# Altium schematic sheet Sheet_1 copy.schdoc
size 127 x 101 mm
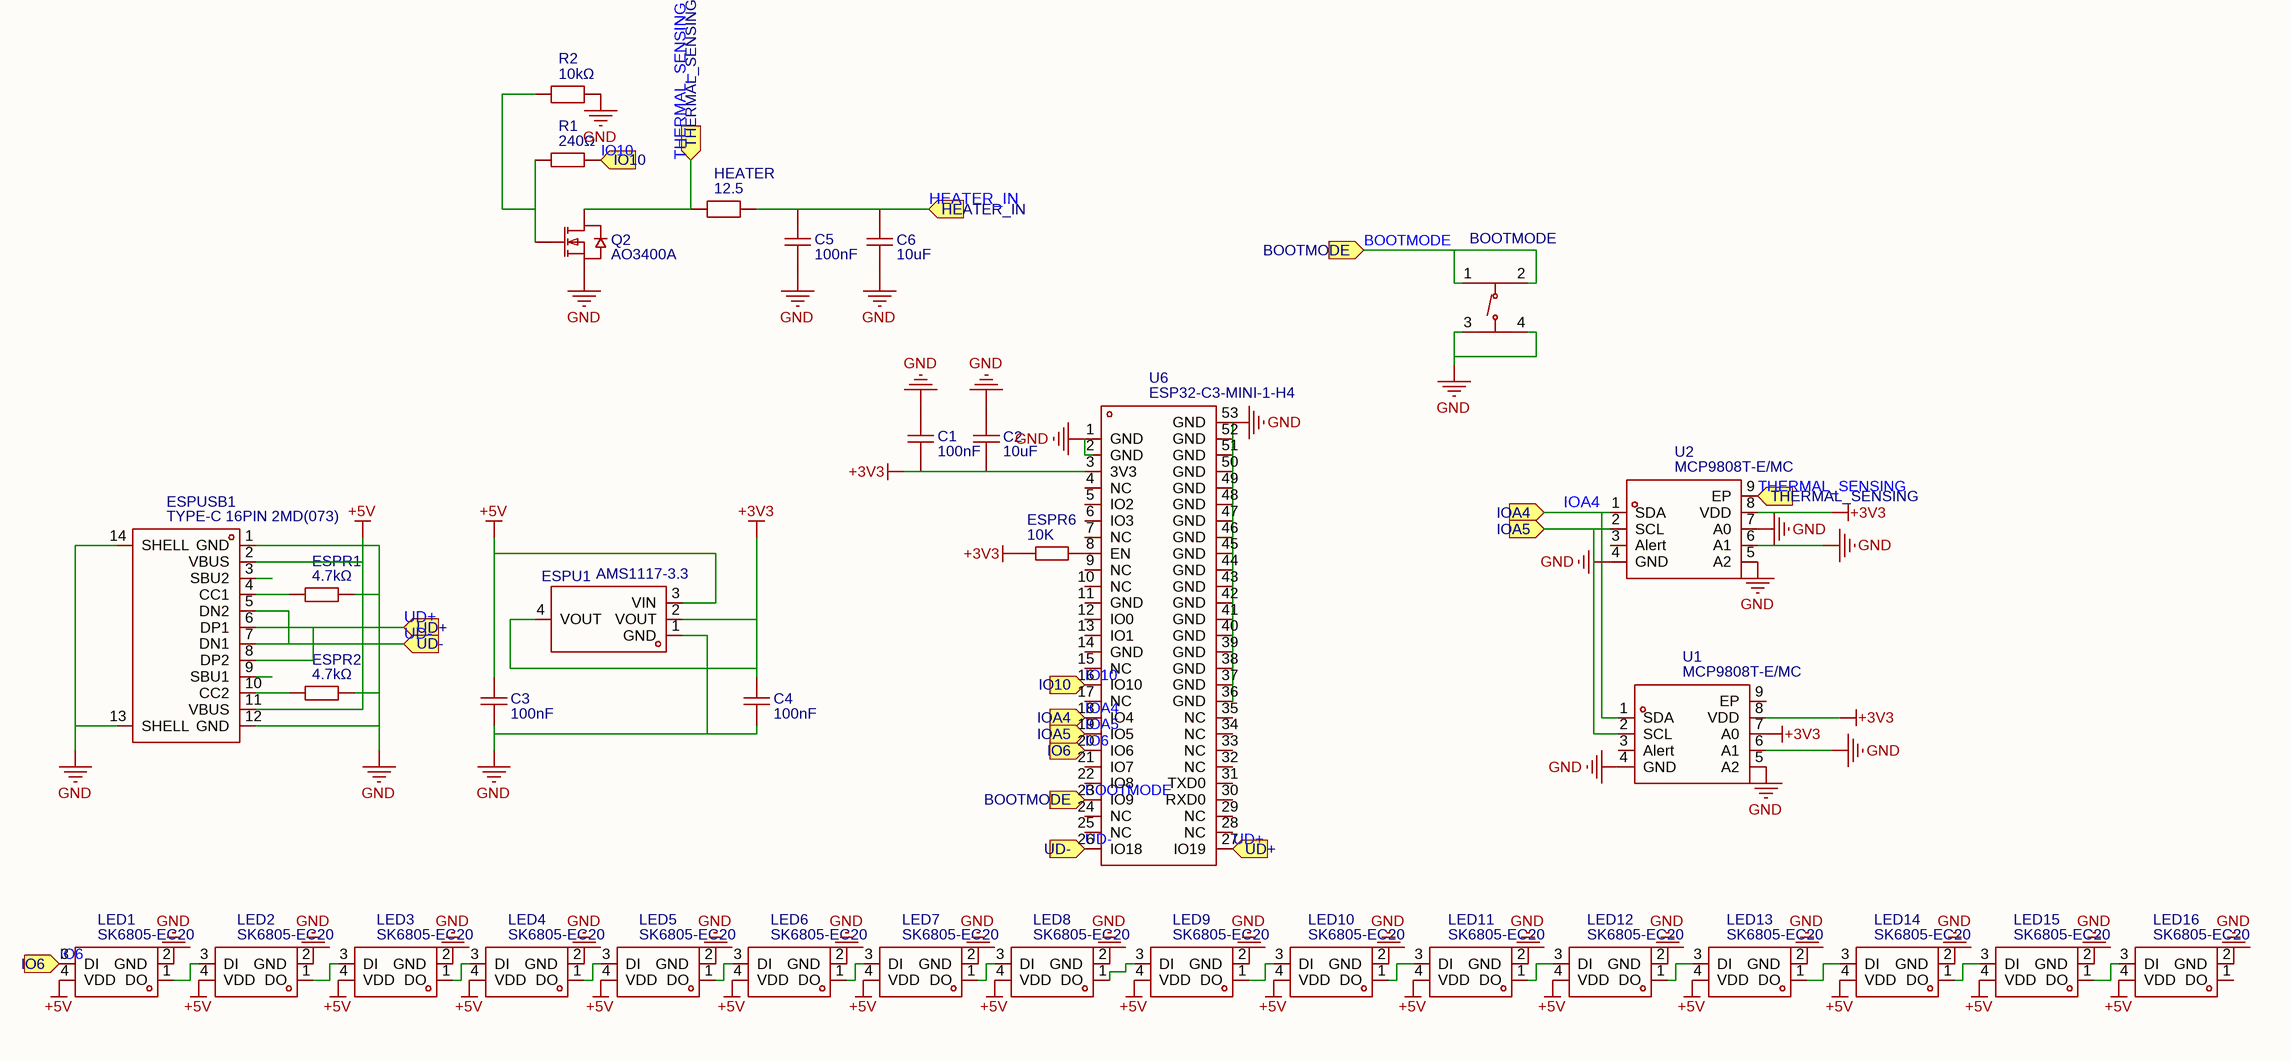
[diagram p0: Sheet_1 copy.schdoc]

## Parts
BOOTMODE  TS-1187A-B-A-B  [SW-SMD_4P-L5.1-W5.1-P3.70-LS6.5-TL-2]  (value not drawn)
C1  100nF  [C0603]
C2  10uF  [C0805]
C3  100nF  [C0603]
C4  100nF  [C0603]
C5  100nF  [C0603]
C6  10uF  [C0805]
ESPR1  4.7kΩ  [R0402]
ESPR2  4.7kΩ  [R0402]
ESPR6  10K  [R0402]
ESPU1  AMS1117-3.3  [SOT-223-3_L6.5-W3.4-P2.30-LS7.0-BR]
ESPUSB1  TYPE-C 16PIN 2MD(073)  [USB-C-SMD_TYPE-C-6PIN-2MD-073]
HEATER  12.5
LED1  SK6805-EC20  [LED-SMD_4P-L2.0-W2.0-TL_WS2812B-2020]
LED2  SK6805-EC20  [LED-SMD_4P-L2.0-W2.0-TL_WS2812B-2020]
LED3  SK6805-EC20  [LED-SMD_4P-L2.0-W2.0-TL_WS2812B-2020]
LED4  SK6805-EC20  [LED-SMD_4P-L2.0-W2.0-TL_WS2812B-2020]
LED5  SK6805-EC20  [LED-SMD_4P-L2.0-W2.0-TL_WS2812B-2020]
LED6  SK6805-EC20  [LED-SMD_4P-L2.0-W2.0-TL_WS2812B-2020]
LED7  SK6805-EC20  [LED-SMD_4P-L2.0-W2.0-TL_WS2812B-2020]
LED8  SK6805-EC20  [LED-SMD_4P-L2.0-W2.0-TL_WS2812B-2020]
LED9  SK6805-EC20  [LED-SMD_4P-L2.0-W2.0-TL_WS2812B-2020]
LED10  SK6805-EC20  [LED-SMD_4P-L2.0-W2.0-TL_WS2812B-2020]
LED11  SK6805-EC20  [LED-SMD_4P-L2.0-W2.0-TL_WS2812B-2020]
LED12  SK6805-EC20  [LED-SMD_4P-L2.0-W2.0-TL_WS2812B-2020]
LED13  SK6805-EC20  [LED-SMD_4P-L2.0-W2.0-TL_WS2812B-2020]
LED14  SK6805-EC20  [LED-SMD_4P-L2.0-W2.0-TL_WS2812B-2020]
LED15  SK6805-EC20  [LED-SMD_4P-L2.0-W2.0-TL_WS2812B-2020]
LED16  SK6805-EC20  [LED-SMD_4P-L2.0-W2.0-TL_WS2812B-2020]
Q2  AO3400A  [SOT-23-3_L2.9-W1.3-P1.90-LS2.4-BR]
R1  240Ω  [R0805]
R2  10kΩ  [R0805]
U1  MCP9808T-E/MC  [DFN-8_L3.0-W2.0-P0.50-TL-EP-1]
U2  MCP9808T-E/MC  [DFN-8_L3.0-W2.0-P0.50-TL-EP-1]
U6  ESP32-C3-MINI-1-H4  [WIFIM-SMD_ESP32-C3-MINI-1]

## Ports
BOOTMODE (in), HEATER_IN (in), IO6 (in), IO10 (in), IOA4 (in), IOA5 (in), THERMAL_SENSING (in), UD+ (in), UD- (in)

## Nets
+3V3: C1.1 C2.2 C4.2 ESPR6.2 ESPU1.2(VOUT) ESPU1.4(VOUT) U1.7(A0) U1.8(VDD) U2.8(VDD) U6.3(3V3)
+5V: C3.2 ESPU1.3(VIN) ESPUSB1.2(VBUS) ESPUSB1.11(VBUS) LED1.4(VDD) LED2.4(VDD) LED3.4(VDD) LED4.4(VDD) LED5.4(VDD) LED6.4(VDD) LED7.4(VDD) LED8.4(VDD) LED9.4(VDD) LED10.4(VDD) LED11.4(VDD) LED12.4(VDD) LED13.4(VDD) LED14.4(VDD) LED15.4(VDD) LED16.4(VDD)
GND: BOOTMODE.3(C) BOOTMODE.4(D) C1.2 C2.1 C3.1 C4.1 C5.1 C6.2 ESPR1.2 ESPR2.2 ESPU1.1(GND) ESPUSB1.1(GND) ESPUSB1.12(GND) ESPUSB1.13(SHELL) ESPUSB1.14(SHELL) LED1.2(GND) LED2.2(GND) LED3.2(GND) LED4.2(GND) LED5.2(GND) LED6.2(GND) LED7.2(GND) LED8.2(GND) LED9.2(GND) LED10.2(GND) LED11.2(GND) LED12.2(GND) LED13.2(GND) LED14.2(GND) LED15.2(GND) LED16.2(GND) Q2.2(S) R2.2 U1.4(GND) U1.5(A2) U1.6(A1) U2.4(GND) U2.5(A2) U2.6(A1) U2.7(A0) U6.1(GND) U6.2(GND) U6.36(GND) U6.37(GND) U6.38(GND) U6.39(GND) U6.40(GND) U6.41(GND) U6.42(GND) U6.43(GND) U6.44(GND) U6.45(GND) U6.46(GND) U6.47(GND) U6.48(GND) U6.49(GND) U6.50(GND) U6.51(GND) U6.52(GND) U6.53(GND)
BOOTMODE: BOOTMODE.1(A) BOOTMODE.2(B) U6.23(IO9) ; port BOOTMODE
HEATER_IN: C5.2 C6.1 HEATER.2 ; port HEATER_IN
IO6: LED1.3(DI) U6.20(IO6) ; port IO6
IO10: R1.2 U6.16(IO10) ; port IO10
IOA4: U1.1(SDA) U2.1(SDA) U6.18(IO4) ; port IOA4
IOA5: U1.2(SCL) U2.2(SCL) U6.19(IO5) ; port IOA5
THERMAL_SENSING: HEATER.1 Q2.3(D) U2.9(EP) ; port THERMAL_SENSING
UD+: ESPUSB1.6(DP1) ESPUSB1.8(DP2) U6.27(IO19) ; port UD+
UD-: ESPUSB1.5(DN2) ESPUSB1.7(DN1) U6.26(IO18) ; port UD-
NetESPR1_1: ESPR1.1 ESPUSB1.4(CC1)
NetESPR2_1: ESPR2.1 ESPUSB1.10(CC2)
NetESPR6_1: ESPR6.1 U6.8(EN)
NetLED1_1: LED1.1(DO) LED2.3(DI)
NetLED2_1: LED2.1(DO) LED3.3(DI)
NetLED3_1: LED3.1(DO) LED4.3(DI)
NetLED4_1: LED4.1(DO) LED5.3(DI)
NetLED5_1: LED5.1(DO) LED6.3(DI)
NetLED6_1: LED6.1(DO) LED7.3(DI)
NetLED7_1: LED7.1(DO) LED8.3(DI)
NetLED8_1: LED8.1(DO) LED9.3(DI)
NetLED9_1: LED9.1(DO) LED10.3(DI)
NetLED10_1: LED10.1(DO) LED11.3(DI)
NetLED11_1: LED11.1(DO) LED12.3(DI)
NetLED12_1: LED12.1(DO) LED13.3(DI)
NetLED13_1: LED13.1(DO) LED14.3(DI)
NetLED14_1: LED14.1(DO) LED15.3(DI)
NetLED15_1: LED15.1(DO) LED16.3(DI)
NetQ2_1: Q2.1(G) R1.1 R2.1

Not connected (* = marked no-connect by the designer): ESPUSB1 3(SBU2) 9(SBU1); LED16 1(DO); U1 3(Alert) 9(EP); U2 3(Alert); U6 4(NC) 5(IO2) 6(IO3) 7(NC) 9(NC) 10(NC) 11(GND) 12(IO0) 13(IO1) 14(GND) 15(NC) 17(NC) 21(IO7) 22(IO8) 24(NC) 25(NC) 28(NC) 29(NC) 30(RXD0) 31(TXD0) 32(NC) 33(NC) 34(NC) 35(NC)

## Library data of the parts
BOOTMODE = TS-1187A-B-A-B: Manufacturer: XKB Connectivity(中国星坤); Contributor: LCSC; Convert to PCB: yes; UniqueId: gge6f5c0bc02024a939; Origin Footprint: SW-SMD_4P-L5.1-W5.1-P3.70-LS6.5-TL-2; Device: TS-1187A-B-A-B; Symbol: TS-1187A-B-A-B; Supplier: LCSC; Supplier Part: C318884; Manufacturer Part: TS-1187A-B-A-B; JLCPCB Part Class: Basic Part; link: https://lcsc.com/eda_search?q=C318884&%26type=1&ref=editor; spicePre: S; spiceSymbolName: TS-1187A-B-A-B; Add into BOM: yes; FootprintName: SW-SMD_4P-L5.1-W5.1-P3.70-LS6.5-TL-2
C1 = 100nF: Manufacturer: SAMSUNG(三星); Manufacturer Part: CL10B104KB8NNNC; nameAlias: Value; Convert to PCB: yes; UniqueId: gge84f2f2bcbf7fae9e; ModelId: aa7bfa10aa9749d3a2674a0b8f4166b3; Origin Footprint: C0603; Device: 100nF; Symbol: 100nF; Supplier: LCSC; Supplier Part: C1591; JLCPCB Part Class: Extended Part; spicePre: C; spiceSymbolName: CL10B104KB8NNNC; Add into BOM: yes; FootprintName: C0603; ModelName: C0603
C2 = 10uF: Manufacturer Part: CL21A106KAYNNNE; Manufacturer: SAMSUNG(三星); nameAlias: Value; Convert to PCB: yes; UniqueId: gge08d787491a595ea2; Origin Footprint: C0805; Device: 10uF; Symbol: 10uF; Supplier: LCSC; Supplier Part: C15850; JLCPCB Part Class: Basic Part; spicePre: C; spiceSymbolName: CL21A106KAYNNNE; Add into BOM: yes; FootprintName: C0805
C3 = 100nF: Manufacturer: SAMSUNG(三星); Manufacturer Part: CL10B104KB8NNNC; nameAlias: Value; Convert to PCB: yes; UniqueId: ggec7a2ba2ae3201229; ModelId: aa7bfa10aa9749d3a2674a0b8f4166b3; Origin Footprint: C0603; Device: 100nF; Symbol: 100nF; Supplier: LCSC; Supplier Part: C1591; JLCPCB Part Class: Extended Part; spicePre: C; spiceSymbolName: CL10B104KB8NNNC; Add into BOM: yes; FootprintName: C0603; ModelName: C0603
C4 = 100nF: Manufacturer: SAMSUNG(三星); Manufacturer Part: CL10B104KB8NNNC; nameAlias: Value; Convert to PCB: yes; UniqueId: gge816a6adfd29f7601; ModelId: aa7bfa10aa9749d3a2674a0b8f4166b3; Origin Footprint: C0603; Device: 100nF; Symbol: 100nF; Supplier: LCSC; Supplier Part: C1591; JLCPCB Part Class: Extended Part; spicePre: C; spiceSymbolName: CL10B104KB8NNNC; Add into BOM: yes; FootprintName: C0603; ModelName: C0603
C5 = 100nF: Manufacturer: SAMSUNG(三星); Manufacturer Part: CL10B104KB8NNNC; nameAlias: Value; Convert to PCB: yes; UniqueId: ggef034be5c27e22ecd; ModelId: aa7bfa10aa9749d3a2674a0b8f4166b3; Origin Footprint: C0603; Device: 100nF; Symbol: 100nF; Supplier: LCSC; Supplier Part: C1591; JLCPCB Part Class: Extended Part; spicePre: C; spiceSymbolName: CL10B104KB8NNNC; Add into BOM: yes; FootprintName: C0603; ModelName: C0603
C6 = 10uF: Manufacturer Part: CL21A106KAYNNNE; Manufacturer: SAMSUNG(三星); nameAlias: Value; Convert to PCB: yes; UniqueId: gge3116aae71de1f0fc; Origin Footprint: C0805; Device: 10uF; Symbol: 10uF; Supplier: LCSC; Supplier Part: C15850; JLCPCB Part Class: Basic Part; spicePre: C; spiceSymbolName: CL21A106KAYNNNE; Add into BOM: yes; FootprintName: C0805
ESPR1 = 4.7kΩ: Manufacturer: UniOhm; Manufacturer Part: 0402WGF4701TCE; nameAlias: Resistance; Convert to PCB: yes; UniqueId: gge7ddcad7e77d19d0b; Resistance: 4.7K; Origin Footprint: R0402; Device: 4.7kΩ; Symbol: 4.7kΩ; Supplier: LCSC; Supplier Part: C25900; JLCPCB Part Class: Basic Part; spicePre: R; spiceSymbolName: 0402WGF4701TCE; Add into BOM: yes; FootprintName: R0402
ESPR2 = 4.7kΩ: Manufacturer: UniOhm; Manufacturer Part: 0402WGF4701TCE; nameAlias: Resistance; Convert to PCB: yes; UniqueId: gge07cadfaee7eab313; Resistance: 4.7K; Origin Footprint: R0402; Device: 4.7kΩ; Symbol: 4.7kΩ; Supplier: LCSC; Supplier Part: C25900; JLCPCB Part Class: Basic Part; spicePre: R; spiceSymbolName: 0402WGF4701TCE; Add into BOM: yes; FootprintName: R0402
ESPR6 = 10K: Manufacturer: UniOhm; Manufacturer Part: 0402WGF1002TCE; nameAlias: Resistance (Ohms); Convert to PCB: yes; UniqueId: ggec3da87eea95b4c0c; Origin Footprint: R0402; Device: 10K; Symbol: 10K; Supplier: LCSC; Supplier Part: C25744; JLCPCB Part Class: Basic Part; spicePre: R; spiceSymbolName: 0402WGF1002TCE; Add into BOM: yes; FootprintName: R0402
ESPU1 = AMS1117-3.3: Manufacturer: AMS; sourceId: dwIGgezVh; Convert to PCB: yes; UniqueId: ggecf1c38b7d7d46bad; Origin Footprint: SOT-223-3_L6.5-W3.4-P2.30-LS7.0-BR; Device: AMS1117-3.3; Symbol: AMS1117-3.3; timeStamp: 1476261164; Supplier: LCSC; Manufacturer Part: AMS1117-3.3; Supplier Part: C6186; JLCPCB Part Class: Basic Part; spicePre: U; spiceSymbolName: AMS1117-3.3; Add into BOM: yes; FootprintName: SOT-223-3_L6.5-W3.4-P2.30-LS7.0-BR
ESPUSB1 = TYPE-C 16PIN 2MD(073): Manufacturer: SHOU HAN(首韩); Contributor: LCSC; Convert to PCB: yes; UniqueId: ggecd2bb17442b0efce; ModelId: e7514eef573e45b68df9e9a6124b2532; Origin Footprint: USB-C-SMD_TYPE-C-6PIN-2MD-073; Device: TYPE-C 16PIN 2MD(073); Symbol: TYPE-C 16PIN 2MD(073); Supplier: LCSC; Supplier Part: C2765186; Manufacturer Part: TYPE-C 16PIN 2MD(073); JLCPCB Part Class: Extended Part; spicePre: U; spiceSymbolName: TYPE-C 16PIN 2MD(073); Add into BOM: yes; FootprintName: USB-C-SMD_TYPE-C-6PIN-2MD-073; ModelName: USB-C-SMD_TYPE-C-6PIN-2MD-073
HEATER = 12.5: Origin Footprint: HEATER_SPIRAL_5CM; nameAlias: Value(Ω); Contributor: LCEDA_Lib; Package Display: No; Convert to PCB: yes; UniqueId: gge0336805703def1c8; Device: 12.5; Symbol: 12.5; spicePre: R; spiceSymbolName: R_0603_EU; Add into BOM: yes
LED1 = SK6805-EC20: Manufacturer: OPSCO Optoelectronics; Contributor: LCSC; Paste Type: expand; Convert to PCB: yes; UniqueId: gge16e2428176fb5ac1; Origin Footprint: LED-SMD_4P-L2.0-W2.0-TL_WS2812B-2020; Device: SK6805-EC20; Symbol: SK6805-EC20; Supplier: LCSC; Supplier Part: C2890036; Manufacturer Part: SK6805-EC20; LCSC Assembly: Yes; spicePre: L; spiceSymbolName: WS2812B-2020; Add into BOM: yes; JLCPCB Part Class: Extend; FootprintName: LED-SMD_4P-L2.0-W2.0-TL_WS2812B-2020
LED2 = SK6805-EC20: Manufacturer: OPSCO Optoelectronics; Contributor: LCSC; Paste Type: expand; Convert to PCB: yes; UniqueId: gge4831e16003f23f36; Origin Footprint: LED-SMD_4P-L2.0-W2.0-TL_WS2812B-2020; Device: SK6805-EC20; Symbol: SK6805-EC20; Supplier: LCSC; Supplier Part: C2890036; Manufacturer Part: SK6805-EC20; LCSC Assembly: Yes; spicePre: L; spiceSymbolName: WS2812B-2020; Add into BOM: yes; JLCPCB Part Class: Extend; FootprintName: LED-SMD_4P-L2.0-W2.0-TL_WS2812B-2020
LED3 = SK6805-EC20: Manufacturer: OPSCO Optoelectronics; Contributor: LCSC; Paste Type: expand; Convert to PCB: yes; UniqueId: ggeac12866c02b89667; Origin Footprint: LED-SMD_4P-L2.0-W2.0-TL_WS2812B-2020; Device: SK6805-EC20; Symbol: SK6805-EC20; Supplier: LCSC; Supplier Part: C2890036; Manufacturer Part: SK6805-EC20; LCSC Assembly: Yes; spicePre: L; spiceSymbolName: WS2812B-2020; Add into BOM: yes; JLCPCB Part Class: Extend; FootprintName: LED-SMD_4P-L2.0-W2.0-TL_WS2812B-2020
LED4 = SK6805-EC20: Manufacturer: OPSCO Optoelectronics; Contributor: LCSC; Paste Type: expand; Convert to PCB: yes; UniqueId: ggef2f2a78f3e332c30; Origin Footprint: LED-SMD_4P-L2.0-W2.0-TL_WS2812B-2020; Device: SK6805-EC20; Symbol: SK6805-EC20; Supplier: LCSC; Supplier Part: C2890036; Manufacturer Part: SK6805-EC20; LCSC Assembly: Yes; spicePre: L; spiceSymbolName: WS2812B-2020; Add into BOM: yes; JLCPCB Part Class: Extend; FootprintName: LED-SMD_4P-L2.0-W2.0-TL_WS2812B-2020
LED5 = SK6805-EC20: Manufacturer: OPSCO Optoelectronics; Contributor: LCSC; Paste Type: expand; Convert to PCB: yes; UniqueId: gged071155d0386b246; Origin Footprint: LED-SMD_4P-L2.0-W2.0-TL_WS2812B-2020; Device: SK6805-EC20; Symbol: SK6805-EC20; Supplier: LCSC; Supplier Part: C2890036; Manufacturer Part: SK6805-EC20; LCSC Assembly: Yes; spicePre: L; spiceSymbolName: WS2812B-2020; Add into BOM: yes; JLCPCB Part Class: Extend; FootprintName: LED-SMD_4P-L2.0-W2.0-TL_WS2812B-2020
LED6 = SK6805-EC20: Manufacturer: OPSCO Optoelectronics; Contributor: LCSC; Paste Type: expand; Convert to PCB: yes; UniqueId: gge5d75848ffcb53855; Origin Footprint: LED-SMD_4P-L2.0-W2.0-TL_WS2812B-2020; Device: SK6805-EC20; Symbol: SK6805-EC20; Supplier: LCSC; Supplier Part: C2890036; Manufacturer Part: SK6805-EC20; LCSC Assembly: Yes; spicePre: L; spiceSymbolName: WS2812B-2020; Add into BOM: yes; JLCPCB Part Class: Extend; FootprintName: LED-SMD_4P-L2.0-W2.0-TL_WS2812B-2020
LED7 = SK6805-EC20: Manufacturer: OPSCO Optoelectronics; Contributor: LCSC; Paste Type: expand; Convert to PCB: yes; UniqueId: ggef4a3615eb5ab47c3; Origin Footprint: LED-SMD_4P-L2.0-W2.0-TL_WS2812B-2020; Device: SK6805-EC20; Symbol: SK6805-EC20; Supplier: LCSC; Supplier Part: C2890036; Manufacturer Part: SK6805-EC20; LCSC Assembly: Yes; spicePre: L; spiceSymbolName: WS2812B-2020; Add into BOM: yes; JLCPCB Part Class: Extend; FootprintName: LED-SMD_4P-L2.0-W2.0-TL_WS2812B-2020
LED8 = SK6805-EC20: Manufacturer: OPSCO Optoelectronics; Contributor: LCSC; Paste Type: expand; Convert to PCB: yes; UniqueId: gge5cbee354d664d626; Origin Footprint: LED-SMD_4P-L2.0-W2.0-TL_WS2812B-2020; Device: SK6805-EC20; Symbol: SK6805-EC20; Supplier: LCSC; Supplier Part: C2890036; Manufacturer Part: SK6805-EC20; LCSC Assembly: Yes; spicePre: L; spiceSymbolName: WS2812B-2020; Add into BOM: yes; JLCPCB Part Class: Extend; FootprintName: LED-SMD_4P-L2.0-W2.0-TL_WS2812B-2020
LED9 = SK6805-EC20: Manufacturer: OPSCO Optoelectronics; Contributor: LCSC; Paste Type: expand; Convert to PCB: yes; UniqueId: ggef17ec63d8c29d430; Origin Footprint: LED-SMD_4P-L2.0-W2.0-TL_WS2812B-2020; Device: SK6805-EC20; Symbol: SK6805-EC20; Supplier: LCSC; Supplier Part: C2890036; Manufacturer Part: SK6805-EC20; LCSC Assembly: Yes; spicePre: L; spiceSymbolName: WS2812B-2020; Add into BOM: yes; JLCPCB Part Class: Extend; FootprintName: LED-SMD_4P-L2.0-W2.0-TL_WS2812B-2020
LED10 = SK6805-EC20: Manufacturer: OPSCO Optoelectronics; Contributor: LCSC; Paste Type: expand; Convert to PCB: yes; UniqueId: ggea1d88f658543825f; Origin Footprint: LED-SMD_4P-L2.0-W2.0-TL_WS2812B-2020; Device: SK6805-EC20; Symbol: SK6805-EC20; Supplier: LCSC; Supplier Part: C2890036; Manufacturer Part: SK6805-EC20; LCSC Assembly: Yes; spicePre: L; spiceSymbolName: WS2812B-2020; Add into BOM: yes; JLCPCB Part Class: Extend; FootprintName: LED-SMD_4P-L2.0-W2.0-TL_WS2812B-2020
LED11 = SK6805-EC20: Manufacturer: OPSCO Optoelectronics; Contributor: LCSC; Paste Type: expand; Convert to PCB: yes; UniqueId: gge045fbb865a0502c6; Origin Footprint: LED-SMD_4P-L2.0-W2.0-TL_WS2812B-2020; Device: SK6805-EC20; Symbol: SK6805-EC20; Supplier: LCSC; Supplier Part: C2890036; Manufacturer Part: SK6805-EC20; LCSC Assembly: Yes; spicePre: L; spiceSymbolName: WS2812B-2020; Add into BOM: yes; JLCPCB Part Class: Extend; FootprintName: LED-SMD_4P-L2.0-W2.0-TL_WS2812B-2020
LED12 = SK6805-EC20: Manufacturer: OPSCO Optoelectronics; Contributor: LCSC; Paste Type: expand; Convert to PCB: yes; UniqueId: gge3f5d3c1c5bb2b66e; Origin Footprint: LED-SMD_4P-L2.0-W2.0-TL_WS2812B-2020; Device: SK6805-EC20; Symbol: SK6805-EC20; Supplier: LCSC; Supplier Part: C2890036; Manufacturer Part: SK6805-EC20; LCSC Assembly: Yes; spicePre: L; spiceSymbolName: WS2812B-2020; Add into BOM: yes; JLCPCB Part Class: Extend; FootprintName: LED-SMD_4P-L2.0-W2.0-TL_WS2812B-2020
LED13 = SK6805-EC20: Manufacturer: OPSCO Optoelectronics; Contributor: LCSC; Paste Type: expand; Convert to PCB: yes; UniqueId: ggea01daf176ac06529; Origin Footprint: LED-SMD_4P-L2.0-W2.0-TL_WS2812B-2020; Device: SK6805-EC20; Symbol: SK6805-EC20; Supplier: LCSC; Supplier Part: C2890036; Manufacturer Part: SK6805-EC20; LCSC Assembly: Yes; spicePre: L; spiceSymbolName: WS2812B-2020; Add into BOM: yes; JLCPCB Part Class: Extend; FootprintName: LED-SMD_4P-L2.0-W2.0-TL_WS2812B-2020
LED14 = SK6805-EC20: Manufacturer: OPSCO Optoelectronics; Contributor: LCSC; Paste Type: expand; Convert to PCB: yes; UniqueId: gge8b3037d2bccbcd38; Origin Footprint: LED-SMD_4P-L2.0-W2.0-TL_WS2812B-2020; Device: SK6805-EC20; Symbol: SK6805-EC20; Supplier: LCSC; Supplier Part: C2890036; Manufacturer Part: SK6805-EC20; LCSC Assembly: Yes; spicePre: L; spiceSymbolName: WS2812B-2020; Add into BOM: yes; JLCPCB Part Class: Extend; FootprintName: LED-SMD_4P-L2.0-W2.0-TL_WS2812B-2020
LED15 = SK6805-EC20: Manufacturer: OPSCO Optoelectronics; Contributor: LCSC; Paste Type: expand; Convert to PCB: yes; UniqueId: gge6ea139915b012369; Origin Footprint: LED-SMD_4P-L2.0-W2.0-TL_WS2812B-2020; Device: SK6805-EC20; Symbol: SK6805-EC20; Supplier: LCSC; Supplier Part: C2890036; Manufacturer Part: SK6805-EC20; LCSC Assembly: Yes; spicePre: L; spiceSymbolName: WS2812B-2020; Add into BOM: yes; JLCPCB Part Class: Extend; FootprintName: LED-SMD_4P-L2.0-W2.0-TL_WS2812B-2020
LED16 = SK6805-EC20: Manufacturer: OPSCO Optoelectronics; Contributor: LCSC; Paste Type: expand; Convert to PCB: yes; UniqueId: gge9da179c9f8b112d5; Origin Footprint: LED-SMD_4P-L2.0-W2.0-TL_WS2812B-2020; Device: SK6805-EC20; Symbol: SK6805-EC20; Supplier: LCSC; Supplier Part: C2890036; Manufacturer Part: SK6805-EC20; LCSC Assembly: Yes; spicePre: L; spiceSymbolName: WS2812B-2020; Add into BOM: yes; JLCPCB Part Class: Extend; FootprintName: LED-SMD_4P-L2.0-W2.0-TL_WS2812B-2020
Q2 = AO3400A: Manufacturer: AOS; Convert to PCB: yes; UniqueId: gge24b4816fcc495ee0; Origin Footprint: SOT-23-3_L2.9-W1.3-P1.90-LS2.4-BR; Device: AO3400A; Symbol: AO3400A; Supplier: LCSC; Manufacturer Part: AO3400A; Supplier Part: C20917; JLCPCB Part Class: Basic Part; spicePre: Q; spiceSymbolName: AO3400A; Add into BOM: yes; FootprintName: SOT-23-3_L2.9-W1.3-P1.90-LS2.4-BR
R1 = 240Ω: Manufacturer: LIZ(丽智电子); Manufacturer Part: CR0805J80241G; nameAlias: Value; Convert to PCB: yes; UniqueId: gge2f1939b6910260e3; ModelId: de27d504f5024d53a3020ec2611f5e5e; Origin Footprint: R0805; Device: 240Ω; Symbol: 240Ω; Supplier: LCSC; Supplier Part: C101975; JLCPCB Part Class: Extended Part; spicePre: R; spiceSymbolName: CR0805J80241G; Add into BOM: yes; FootprintName: R0805; ModelName: R0805
R2 = 10kΩ: Manufacturer: Walsin(华新科); Manufacturer Part: MR08X1002FTL; nameAlias: Value; Contributor: LCSC; Convert to PCB: yes; UniqueId: ggef2c458b3ad5f635f; ModelId: de27d504f5024d53a3020ec2611f5e5e; Origin Footprint: R0805; Device: 10kΩ; Symbol: 10kΩ; Supplier: LCSC; Supplier Part: C431835; JLCPCB Part Class: Extended Part; spicePre: R; spiceSymbolName: MR08X1002FTL; Add into BOM: yes; FootprintName: R0805; ModelName: R0805
U1 = MCP9808T-E/MC: Manufacturer: MICROCHIP(美国微芯); Contributor: lcsc; Convert to PCB: yes; UniqueId: gge5aeed73d7dc5cd3b; ModelId: 4c22d24a95194597bf60082080142fd4; Origin Footprint: DFN-8_L3.0-W2.0-P0.50-TL-EP-1; Device: MCP9808T-E/MC; Symbol: MCP9808T-E/MC; Supplier: LCSC; Supplier Part: C194710; Manufacturer Part: MCP9808T-E/MC; JLCPCB Part Class: Extended Part; spicePre: U; spiceSymbolName: MCP9808T-E/MC; Add into BOM: yes; FootprintName: DFN-8_L3.0-W2.0-P0.50-TL-EP-1; ModelName: DFN-8_L3.0-W2.0-P0.50-TL-EP-1
U2 = MCP9808T-E/MC: Manufacturer: MICROCHIP(美国微芯); Contributor: lcsc; Convert to PCB: yes; UniqueId: gge49df00a5f6a81d59; ModelId: 4c22d24a95194597bf60082080142fd4; Origin Footprint: DFN-8_L3.0-W2.0-P0.50-TL-EP-1; Device: MCP9808T-E/MC; Symbol: MCP9808T-E/MC; Supplier: LCSC; Supplier Part: C194710; Manufacturer Part: MCP9808T-E/MC; JLCPCB Part Class: Extended Part; spicePre: U; spiceSymbolName: MCP9808T-E/MC; Add into BOM: yes; FootprintName: DFN-8_L3.0-W2.0-P0.50-TL-EP-1; ModelName: DFN-8_L3.0-W2.0-P0.50-TL-EP-1
U6 = ESP32-C3-MINI-1-H4: Manufacturer: ESPRESSIF(乐鑫); Contributor: LCSC; Convert to PCB: yes; UniqueId: gge3c8a7e08c98b19dd; ModelId: 94355d76a97f49a087f422f34422bfc0; Origin Footprint: WIFIM-SMD_ESP32-C3-MINI-1; Device: ESP32-C3-MINI-1-H4; Symbol: ESP32-C3-MINI-1-H4; Supplier: LCSC; Supplier Part: C2934569; Manufacturer Part: ESP32-C3-MINI-1-H4; JLCPCB Part Class: Extended Part; spicePre: U; spiceSymbolName: ESP32-C3-MINI-1-N4; Add into BOM: yes; FootprintName: WIFIM-SMD_ESP32-C3-MINI-1; ModelName: WIFIM-SMD_ESP32-C3-MINI-1